# Altium schematic sheet al115v20_mcu.SchDoc
size A4; DrawnBy: Suraj K A; Engineer: Suraj K A; Organization: Simcons Control Systems; Address1: HMT Colony PO; Address2: Kalamassery; Address3: Cochin; Address4: India
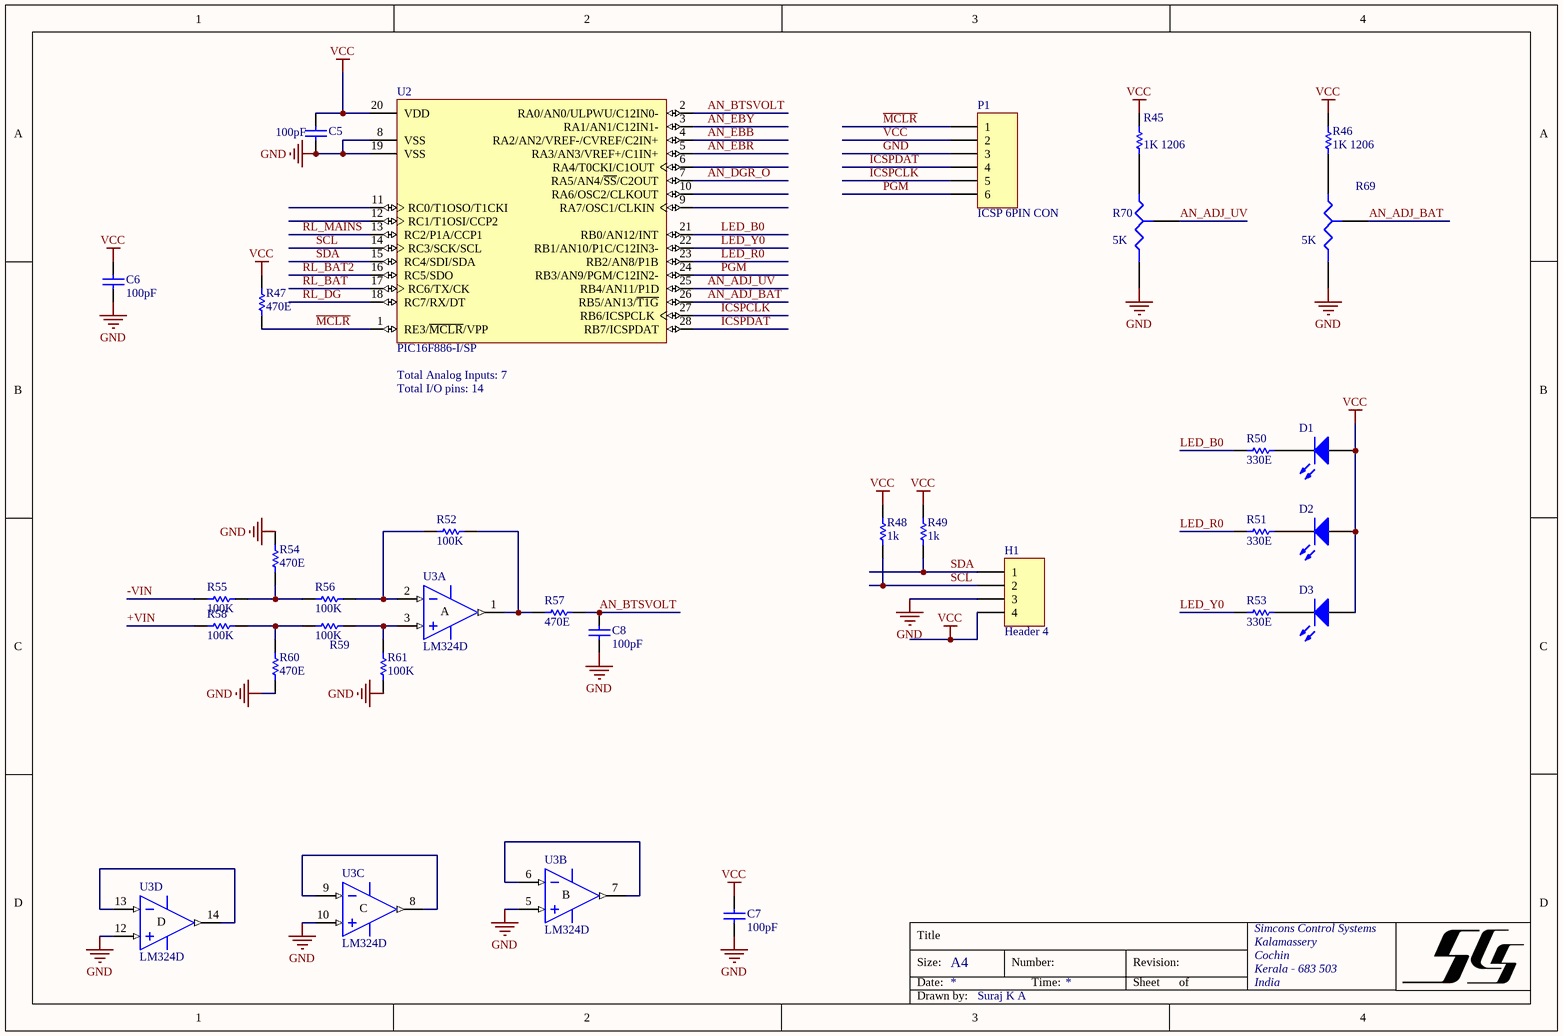
[diagram p0: al115v20_mcu.SchDoc]

## Parts
C5  value 100pF  [C1206]  (hidden comment: .1uF 1206)
C6  value 100pF  [C1206]  (hidden comment: .1uF 1206)
C7  value 100pF  [C1206]  (hidden comment: .1uF 1206)
C8  value 100pF  [C1206]  (hidden comment: 1uF 1206)
D1  LED W/B 5MM  [LED5mmBLUE]  (value not drawn)
D2  LED W/R 5MM  [LED5mmRED]  (value not drawn)
D3  LED W/Y 5MM  [LED5mmYELLOW]  (value not drawn)
H1  Header 4  [CONNDEBUG]
P1  ICSP 6PIN CON  [CON_ICSP]
R45  1K 1206  [R1206]
R46  1K 1206  [R1206]
R47  value 470E  [R1206]  (hidden comment: 4.7K 1206)
R48  value 1k  [R1206]  (hidden comment: 4.7K 1206)
R49  value 1k  [R1206]  (hidden comment: 4.7K 1206)
R50  value 330E  [R1206]  (hidden comment: 1K 1206)
R51  value 330E  [R1206]  (hidden comment: 1K 1206)
R52  value 100K  [R1206]  (hidden comment: 1M 1206)
R53  value 330E  [R1206]  (hidden comment: 1K 1206)
R54  value 470E  [R1206]  (hidden comment: 47K 1206)
R55  value 100K  [AXIAL-0.5]  (hidden comment: MFR 1M .5W)
R56  value 100K  [R1206]  (hidden comment: 1M 1206)
R57  value 470E  [R1206]  (hidden comment: 470K 1206)
R58  value 100K  [AXIAL-0.5]  (hidden comment: MFR 1M .5W)
R59  value 100K  [R1206]  (hidden comment: 1M 1206)
R60  value 470E  [R1206]  (hidden comment: 47K 1206)
R61  value 100K  [R1206]  (hidden comment: 1M 1206)
R69  value 5K  [Bourns_3306F]  (hidden comment: PRESET 5K)
R70  value 5K  [Bourns_3306F]  (hidden comment: PRESET 5K)
U2  PIC16F886-I/SP  [SOIC-SO28_M]
U3  LM324D  [SOIC14_M]  (parts A,B,C,D of 4)

## Nets
GND: C5.1 C6.1 C7.1 C8.1 H1.3 P1.3 R54.1 R60.2 R61.2 R69.3(B) R70.3(B) U2.8(VSS) U2.19(VSS) U3.5(IN+) U3.10(IN+) U3.11(V-) U3.12(IN+)
VCC: C5.2 C6.2 C7.2 D1.1(A) D2.1(A) D3.1(A) H1.4 P1.2 R45.2 R46.2 R47.1 R48.1 R49.1 U2.20(VDD) U3.4(V+)
+VIN: R58.2
-VIN: R55.2
AN_ADJ_BAT: R69.2(TAP) U2.26(RB5/AN13/~{T1G})
AN_ADJ_UV: R70.2(TAP) U2.25(RB4/AN11/P1D)
AN_BTSVOLT: C8.2 R57.2 U2.2(RA0/AN0/ULPWU/C12IN0-)
AN_DGR_O: U2.7(RA5/AN4/~{SS}/C2OUT)
AN_EBB: U2.4(RA2/AN2/VREF-/CVREF/C2IN+)
AN_EBR: U2.5(RA3/AN3/VREF+/C1IN+)
AN_EBY: U2.3(RA1/AN1/C12IN1-)
ICSPCLK: P1.5 U2.27(RB6/ICSPCLK)
ICSPDAT: P1.4 U2.28(RB7/ICSPDAT)
LED_B0: R50.1 U2.21(RB0/AN12/INT)
LED_R0: R51.1 U2.23(RB2/AN8/P1B)
LED_Y0: R53.1 U2.22(RB1/AN10/P1C/C12IN3-)
~{MCLR}: P1.1 R47.2 U2.1(RE3/~{MCLR}/VPP)
PGM: P1.6 U2.24(RB3/AN9/PGM/C12IN2-)
RL_BAT: U2.17(RC6/TX/CK)
RL_BAT2: U2.16(RC5/SDO)
RL_DG: U2.18(RC7/RX/DT)
RL_MAINS: U2.13(RC2/P1A/CCP1)
SCL: H1.2 R48.2 U2.14(RC3/SCK/SCL)
SDA: H1.1 R49.2 U2.15(RC4/SDI/SDA)
NetD1_2: D1.2(K) R50.2
NetD2_2: D2.2(K) R51.2
NetD3_2: D3.2(K) R53.2
NetR45_1: R45.1 R70.1(A)
NetR46_1: R46.1 R69.1(A)
NetR52_1: R52.1 R57.1 U3.1(OUT)
NetR52_2: R52.2 R56.1 U3.2(IN-)
NetR54_2: R54.2 R55.1 R56.2
NetR58_1: R58.1 R59.2 R60.1
NetR59_1: R59.1 R61.1 U3.3(IN+)
NetU3_6: U3.6(IN-) U3.7(OUT)
NetU3_8: U3.8(OUT) U3.9(IN-)
NetU3_13: U3.13(IN-) U3.14(OUT)

Not connected (* = marked no-connect by the designer): U2 6(RA4/T0CKI/C1OUT) 9(RA7/OSC1/CLKIN) 10(RA6/OSC2/CLKOUT) 11(RC0/T1OSO/T1CKI) 12(RC1/T1OSI/CCP2)

## Notes on the sheet
- (near U2) Total Analog Inputs: 7
- Total I/O pins: 14
- Title
- Size:
- Date:
- A4
- Number:
- Time:
- Revision:
- Sheet
- of
- Simcons Control Systems
- Kalamassery
- Cochin
- Kerala - 683 503
- India
- Drawn by:
- (in symbol LM324D, part A) A
- (in symbol LM324D, part B) B
- (in symbol LM324D, part C) C
- (in symbol LM324D, part D) D

## Library data of the parts
C5-C8 = Cap: Capacitor; Published: 8-Jun-2000; LatestRevisionDate: 17-Jul-2002; LatestRevisionNote: Re-released for DXP Platform.; PackageReference: RAD-0.3; Publisher: Altium Limited; PackageDescription: Radial Cap, Thru-Hole; 2 Leads; 0.3 in Pin Spacing
D1-D3 = LED1: Typical RED GaAs LED; Published: 8-Jun-2000; LatestRevisionDate: 08-Jul-2005; LatestRevisionNote: Mech Layer 1 removed.; PackageReference: LED-1; Publisher: Altium Limited; PackageDescription: LED; 2 Leads
H1 = Header 4: Header, 4-Pin; LatestRevisionDate: 17-Jul-2002; LatestRevisionNote: Re-released for DXP Platform.; Publisher: Altium Limited
P1 = Header 6: Header, 6-Pin; LatestRevisionDate: 17-Jul-2002; LatestRevisionNote: Re-released for DXP Platform.; Publisher: Altium Limited
R45 R46 = Res SMT: Semiconductor Resistor; Value: 1.1K; Published: 8-Jun-2000; LatestRevisionDate: 17-Jul-2002; LatestRevisionNote: Re-released for DXP Platform.; PackageReference: AXIAL-0.5; Publisher: Altium Limited; PackageDescription: Axial Device, Thru-Hole; 2 Leads; 0.5 in Pin Spacing
R47-R49 R52 R54-R61 = Res Semi: Semiconductor Resistor; Published: 8-Jun-2000; LatestRevisionDate: 17-Jul-2002; LatestRevisionNote: Re-released for DXP Platform.; PackageReference: AXIAL-0.5; Publisher: Altium Limited; PackageDescription: Axial Device, Thru-Hole; 2 Leads; 0.5 in Pin Spacing
R50 R51 R53 = Res .4: Semiconductor Resistor; Published: 8-Jun-2000; LatestRevisionDate: 17-Jul-2002; LatestRevisionNote: Re-released for DXP Platform.; PackageReference: AXIAL-0.5; Publisher: Altium Limited; PackageDescription: Axial Device, Thru-Hole; 2 Leads; 0.5 in Pin Spacing
R69 R70 = Res Tap: Tapped Resistor; Sim Note: Enter the Resistance value and the set point into parameter fields.; Set Position: 0.5; Published: 24-Mar-1999; LatestRevisionDate: 17-Jul-2002; LatestRevisionNote: Re-released for DXP Platform.; PackageReference: VR3; Publisher: Altium Limited; PackageDescription: Variable Resistor, Thru-Hole; 3 Leads
U2 = PIC16F886-I/SP: Flash-Based, 8-Bit CMOS Microcontroller with nanoWatt Technology, 8K (x14-Bit words) Program Memory, 624 Bytes Data Memory, 24 I/O pins, 28-Pin SPDIP, Standard VDD Range, Industrial Temperature; Published: 29-Jan-2009; LatestRevisionDate: 02-Dec-2009; LatestRevisionNote: Updated datasheet to version revF, Apr-2009.; DatasheetVersion: revF, Apr-2009; PackageVersion: revBB, Aug-2009; PackageReference: SPDIP300-SP28; Publisher: Altium Limited; PackageDescription: 28-Lead Skinny Plastic Dual In-Line (SP) - 300 mil Body [SPDIP]; Supplier 1: Digi-Key; Supplier Part Number 1: PIC16F886-I/SP-ND; Supplier 2: Farnell; Supplier Part Number 2: 1439539; ComponentLink1Description: Datasheet; ComponentLink1URL: http://ww1.microchip.com/downloads/en/DeviceDoc/41291F.pdf; ComponentLink2Description: Packaging Specification; ComponentLink2URL: http://www.microchip.com/stellent/groups/techpub_sg/documents/packagingspec/en012702.pdf; ComponentLink3Description: Microchip.com Home; ComponentLink3URL: http://www.microchip.com/
U3 = LM324D: Quadruple Operational Amplifier; Published: 16-Jan-2001; LatestRevisionDate: 13-Apr-2006; LatestRevisionNote: IPC-7351 Footprint Added.; DatasheetVersion: Feb-1997; PackageVersion: Jan-1998; PackageReference: D014; Publisher: Altium Limited; PackageDescription: 14-Pin Small Outline Integrated Circuit 1.27 mm Pitch; Code_IPC: SOIC127P600-14; ComponentLink1Description: Manufacturer Link; ComponentLink1URL: http://www.ti.com/; ComponentLink2Description: Datasheet; ComponentLink2URL: http://www-s.ti.com/sc/ds/lm324.pdf